# EAGLE schematic cinamin (EAGLE 6.6.0)
AUTHOR: Joshua Adkins; REV: A; REVISION: A
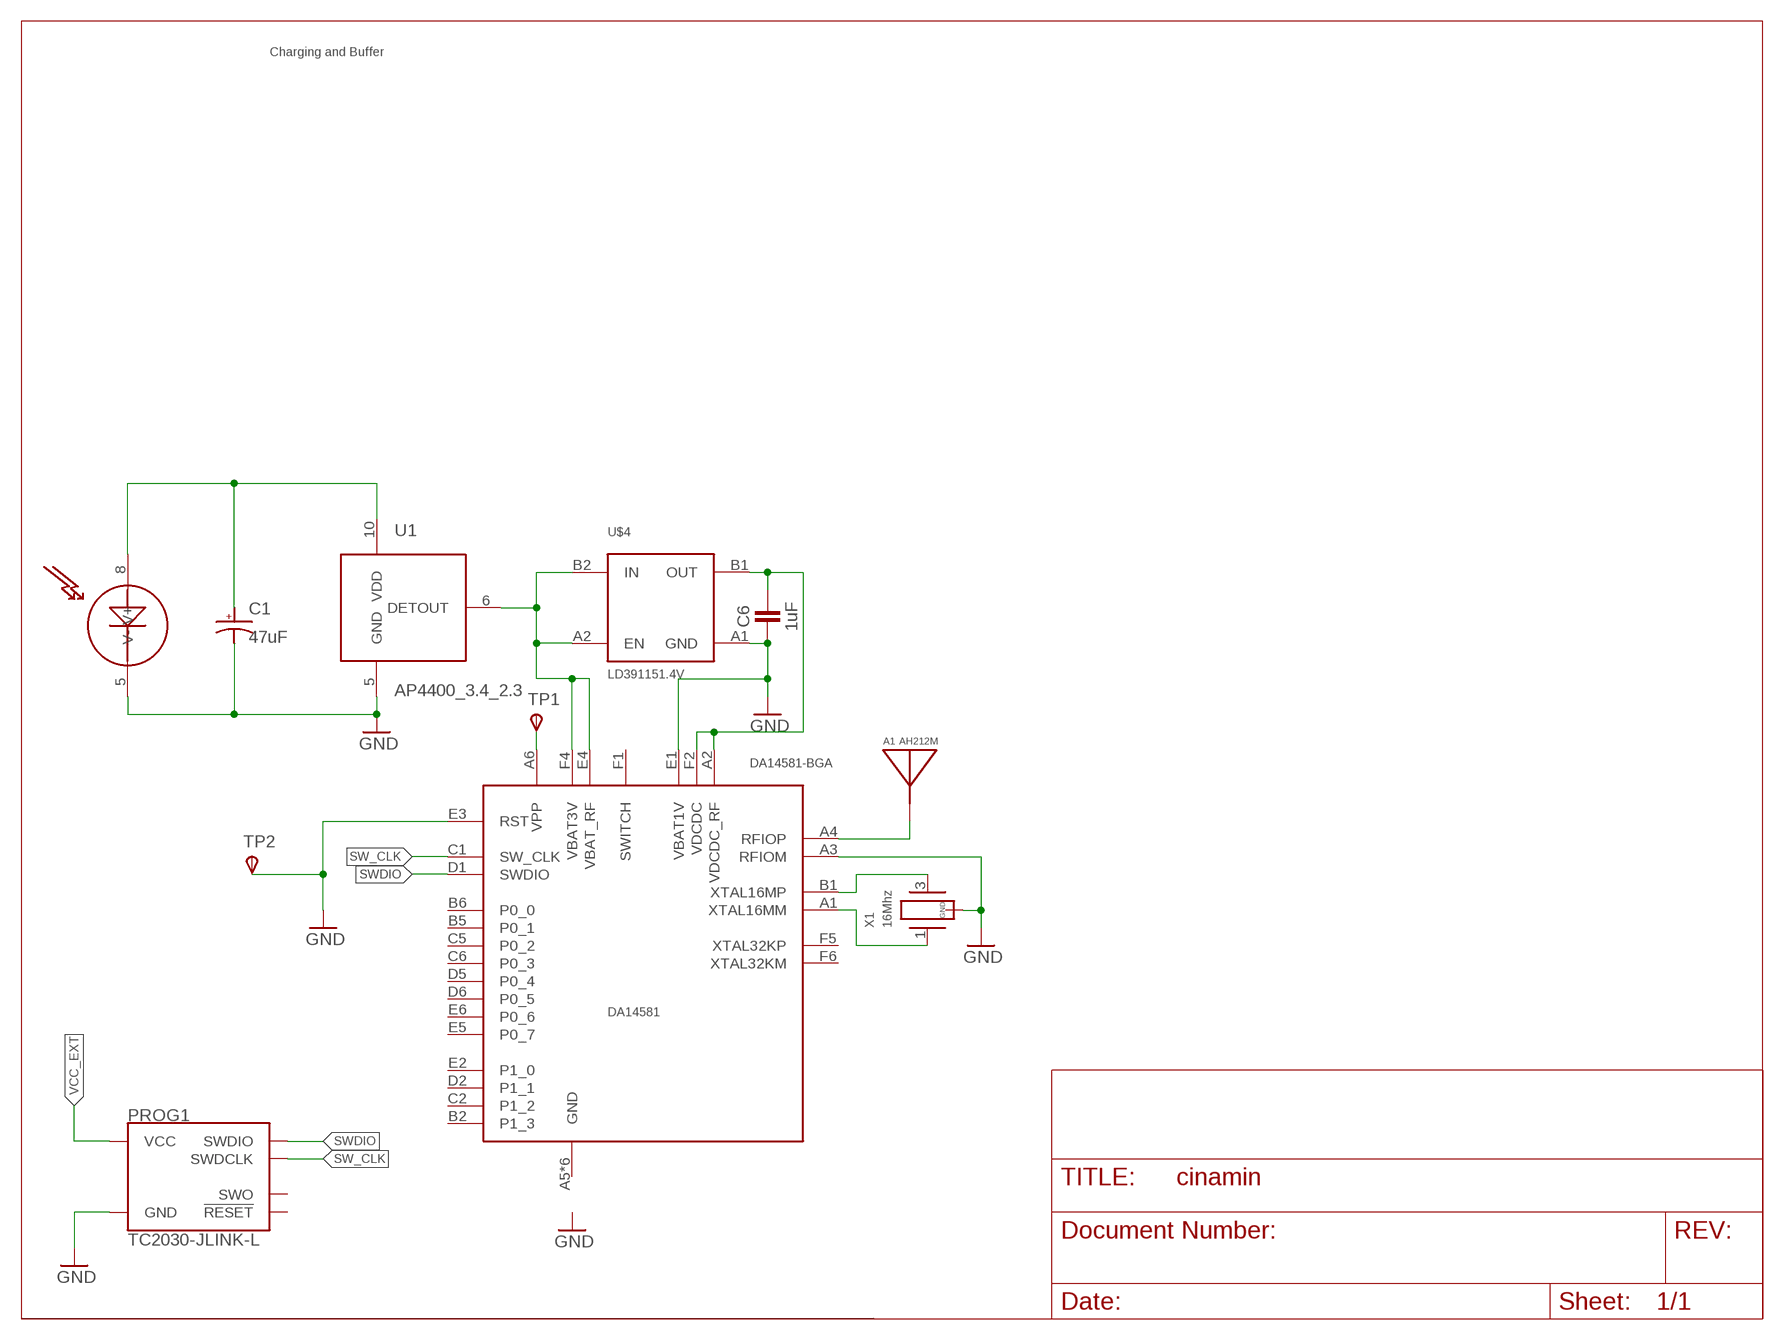
[diagram p0: schematic, sheet 1]

## Parts
A1  AH212M  [AH212M]
C1  47uF  CAP_POL0603_SMALL  [0603_CAP_SMALL]
C6  1uF  CAPACITOR  [0402_CAP]
D1  CPC1822  [SOIC-8]
PROG1  TC2030-JLINK-L  [TC2030-IDC]
TP1  TPSPAD1-13  [P1-13]
TP2  TPSPAD1-13  [P1-13]
U1  AP4400_3.4_2.3  AP4400  [TSOP-10]
U$3  DA14581-BGA  [WLCSP-34]
U$4  LD391151.4V  [FLIP_CHIP-4]
X1  16Mhz  TXC-8Y  [TXC-8Y]

## Nets
GND: C1.NEG(ANODE) C6.2 D1.5(V-) PROG1.5(GND) TP2.TP(PP) U1.5(GND) U$3.A3(RFIOM) U$3.E1(VBAT1V) U$3.E3(RST) U$4.A1(GND) X1.2(GND) X1.4(GND)
N$1: TP1.TP(PP) U$3.A6(VPP)
N$3: C1.POS(CATHODE) D1.8(V+) U1.10(VDD)
N$5: U$3.B1(XTAL16MP) X1.3
N$7: U$3.A1(XTAL16MM) X1.1
N$8: A1.P1(ANTENNA) U$3.A4(RFIOP)
OUT: C6.1 U$3.A2(VDCDC_RF) U$3.F2(VDCDC) U$4.B1(OUT)
SW_CLK: PROG1.4(SWDCLK) U$3.C1(SW_CLK)
SWDIO: PROG1.2(SWDIO) U$3.D1(SWDIO)
VCC: U1.6(DETOUT) U$3.E4(VBAT_RF) U$3.F4(VBAT3V) U$4.A2(EN) U$4.B2(IN)
VCC_EXT: PROG1.1(VCC)
Unconnected: PROG1.3(!RESET) PROG1.6(SWO) U$3.A5(GND) U$3.B2(P1_3) U$3.B4(GND) U$3.B5(P0_1) U$3.B6(P0_0) U$3.C2(P1_2) U$3.C3(GND) U$3.C5(P0_2) U$3.C6(P0_3) U$3.D2(P1_1) U$3.D3(GND) U$3.D4(GND) U$3.D5(P0_4) U$3.D6(P0_5) U$3.E2(P1_0) U$3.E5(P0_7) U$3.E6(P0_6) U$3.F1(SWITCH) U$3.F3(GND) U$3.F5(XTAL32KP) U$3.F6(XTAL32KM)

## Notes on the sheet
- Charging and Buffer

## Library data of the parts
A1 = chips:AH212M: Small 2.4Ghz chip antenna; DIGIKEY: 587-2725-1-ND
C1 = passives:CAP_POL
C6 = passives:CAPACITOR: 0402 Capacitor
D1 = chips:CPC1822: SOIC Solar Cell; DIGIKEY: CLA289-ND
PROG1 = connector:TC2030-JLINK
TP1 TP2 = testpad:TPS: TEST PIN
U1 = chips:AP4400: Ultra Low Power Voltage Detector with Hysterisis; DIGIKEY: CANT_BUY
U$3 = chips:DA14581-BGA: BGA version of the DA14581; DIGIKEY: 1564-1015-1-ND
U$4 = chips:LD39115: Small, low current LDO STMICRO; DIGIKEY: 497-15591-2-ND
X1 = crystals:TXC-8Y: 2mmx1.6mm SMD Crystal